# Altium schematic sheet Sheet1.SchDoc
size Letter; Organization: Altium Limited; Address1: L3, 12a Rodborough Rd; Address2: Frenchs Forest; Address3: NSW; Address4: Australia 2086
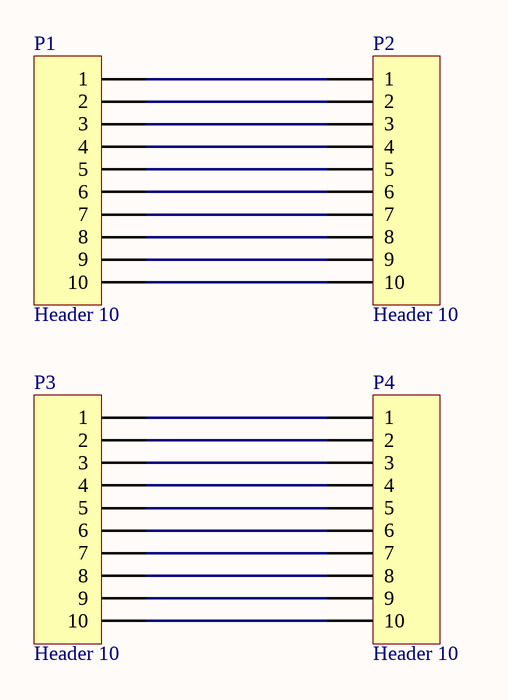
[diagram p0: Sheet1.SchDoc]

## Parts
P1  Header 10  [HDR1X10]
P2  Header 10  [HDR1X10]
P3  Header 10  [HDR1X10]
P4  Header 10  [HDR1X10]

## Nets
NetP1_1: P1.1 P2.1
NetP1_2: P1.2 P2.2
NetP1_3: P1.3 P2.3
NetP1_4: P1.4 P2.4
NetP1_5: P1.5 P2.5
NetP1_6: P1.6 P2.6
NetP1_7: P1.7 P2.7
NetP1_8: P1.8 P2.8
NetP1_9: P1.9 P2.9
NetP1_10: P1.10 P2.10
NetP3_1: P3.1 P4.1
NetP3_2: P3.2 P4.2
NetP3_3: P3.3 P4.3
NetP3_4: P3.4 P4.4
NetP3_5: P3.5 P4.5
NetP3_6: P3.6 P4.6
NetP3_7: P3.7 P4.7
NetP3_8: P3.8 P4.8
NetP3_9: P3.9 P4.9
NetP3_10: P3.10 P4.10

## Notes on the sheet
- Title
- Size:
- Date:
- Letter
- Number:
- Time:
- Revision:
- Sheet
- of
- File:

## Library data of the parts
P1-P4 = Header 10: Header, 10-Pin; LatestRevisionDate: 17-Jul-2002; LatestRevisionNote: Re-released for DXP Platform.; Publisher: Altium Limited